# Altium schematic sheet USB.SchDoc
size A4; SheetNumber: 7; SheetTotal: 15
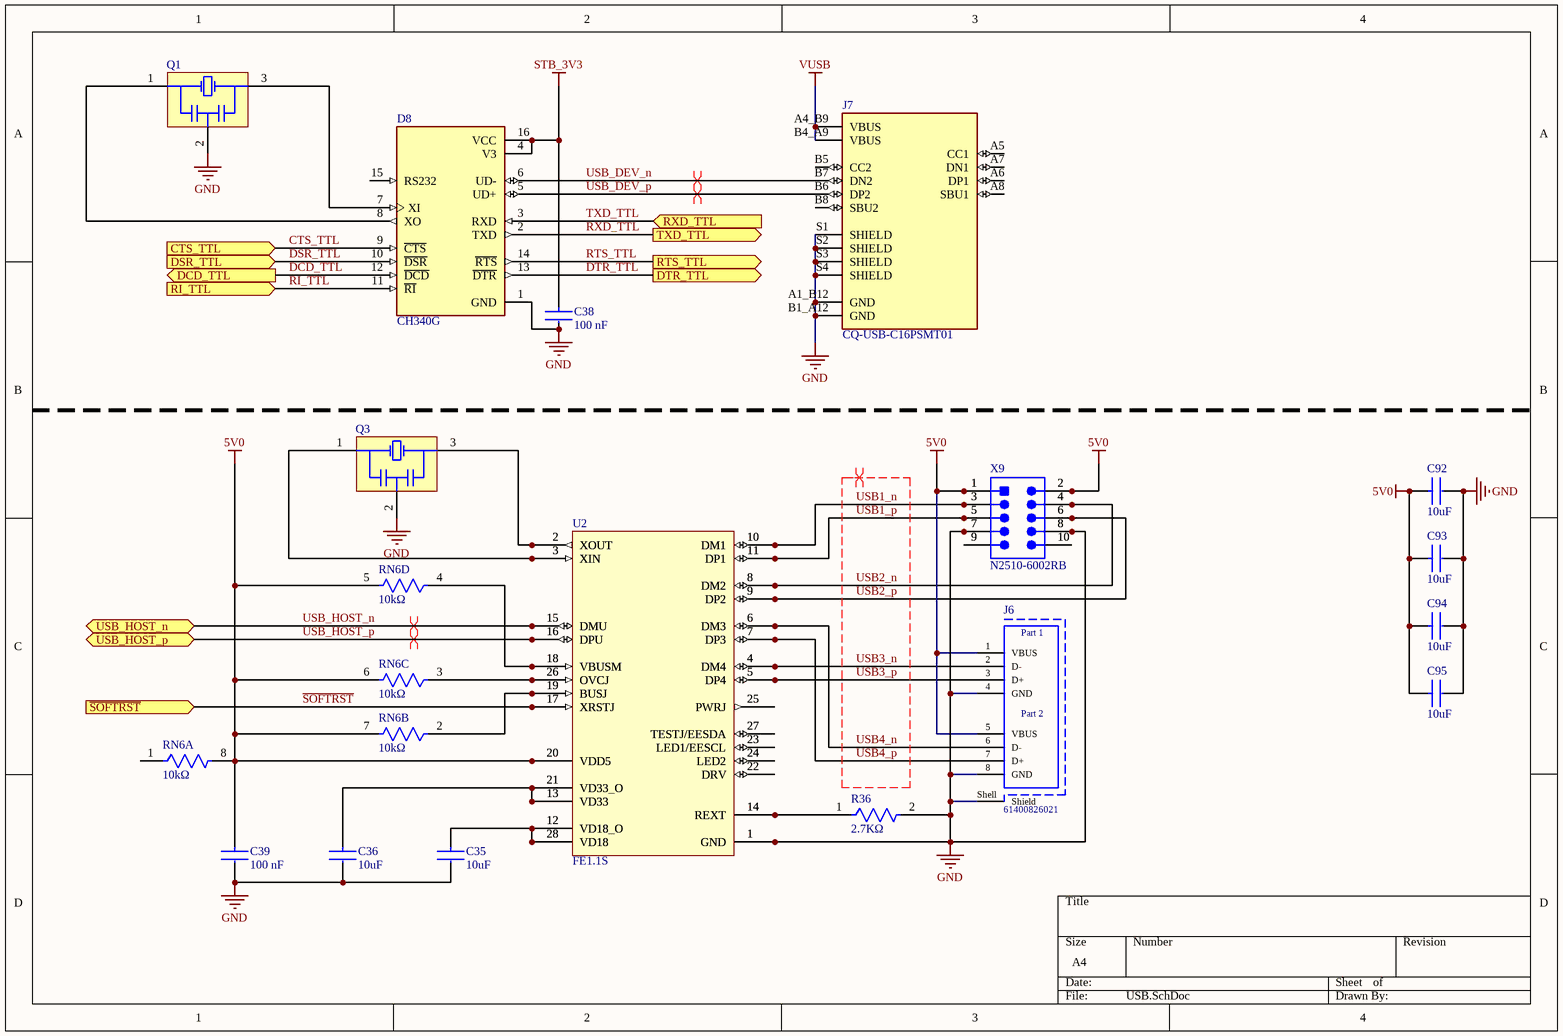
[diagram p0: USB.SchDoc]

## Parts
C35  Capacitance: 10uF  [FP-C0805C-DG-IPC_A]  (hidden comment: C0805C106K8PACTU)
C36  Capacitance: 10uF  [FP-C0805C-DG-IPC_A]  (hidden comment: C0805C106K8PACTU)
C38  Capacitance: 100 nF  [FP-CC0805-0_85-IPC_A]  (hidden comment: CC0805KRX7R9BB104)
C39  Capacitance: 100 nF  [FP-CC0805-0_85-IPC_A]  (hidden comment: CC0805KRX7R9BB104)
C92  Capacitance: 10uF  [FP-C0805C-DG-IPC_A]  (hidden comment: C0805C106K8PACTU)
C93  Capacitance: 10uF  [FP-C0805C-DG-IPC_A]  (hidden comment: C0805C106K8PACTU)
C94  Capacitance: 10uF  [FP-C0805C-DG-IPC_A]  (hidden comment: C0805C106K8PACTU)
C95  Capacitance: 10uF  [FP-C0805C-DG-IPC_A]  (hidden comment: C0805C106K8PACTU)
D8  CH340G  [SOIC127P600X180-16N]
J6  61400826021  [61400826021]
J7  CQ-USB-C16PSMT01  [SHENZHEN-CHUANGQIN-TECHNOLOGY_CQ-USB-C16PSMT01]
Q1  CSTCE12M0G55Z-R0  [MURA-CSTCE_G_V]  (value not drawn)
Q3  CSTCE12M0G55Z-R0  [MURA-CSTCE_G_V]  (value not drawn)
R36  Resistance: 2.7KΩ  [FP-AC0805-IPC_A]  (hidden comment: AC0805FR-072K7L)
RN6  Resistance: 10kΩ  [FP-CAT16-F4-MFG]  (hidden comment: CAT16-1002F4LF)  (parts A,B,C,D of 4)
U2  FE1.1S  [TSOP64P600X160-28L]
X9  N2510-6002RB  [3M-N2510-6002-10_V]

## Ports
CTS_TTL (in), DCD_TTL (out), DSR_TTL (in), DTR_TTL (out), RI_TTL (in), RTS_TTL (out), RXD_TTL (in), TXD_TTL (out), USB_HOST_n (bidir), USB_HOST_p (bidir), ~{SOFTRST} (in)

## Nets
5V0: C39.1 C92.1 C93.1 C94.1 C95.1 J6.1(VBUS) J6.5(VBUS) RN6.5 RN6.6 RN6.7 RN6.8 U2.20(VDD5) X9.1 X9.2
GND: C35.2 C36.2 C38.2 C39.2 C92.2 C93.2 C94.2 C95.2 D8.1(GND) J6.4(GND) J6.8(GND) J6.Shell(Shield) J7.A1_B12(GND) J7.B1_A12(GND) J7.S1(SHIELD) J7.S2(SHIELD) J7.S3(SHIELD) J7.S4(SHIELD) Q1.2(GND) Q3.2(GND) R36.2 U2.1(GND) X9.7 X9.8
STB_3V3: C38.1 D8.4(V3) D8.16(VCC)
VUSB: J7.A4_B9(VBUS) J7.B4_A9(VBUS)
CTS_TTL: D8.9(~{CTS}) ; port CTS_TTL
DCD_TTL: D8.12(~{DCD}) ; port DCD_TTL
DSR_TTL: D8.10(~{DSR}) ; port DSR_TTL
DTR_TTL: D8.13(~{DTR}) ; port DTR_TTL
RI_TTL: D8.11(~{RI}) ; port RI_TTL
RTS_TTL: D8.14(~{RTS}) ; port RTS_TTL
RXD_TTL: D8.2(TXD) ; port TXD_TTL
~{SOFTRST}: U2.17(XRSTJ) ; port ~{SOFTRST}
TXD_TTL: D8.3(RXD) ; port RXD_TTL
USB1_n: U2.10(DM1) X9.3
USB1_p: U2.11(DP1) X9.5
USB2_n: U2.8(DM2) X9.4
USB2_p: U2.9(DP2) X9.6
USB3_n: J6.2(D-) U2.4(DM4)
USB3_p: J6.3(D+) U2.5(DP4)
USB4_n: J6.6(D-) U2.6(DM3)
USB4_p: J6.7(D+) U2.7(DP3)
USB_DEV_n: D8.6(UD-) J7.B7(DN2)
USB_DEV_p: D8.5(UD+) J7.B6(DP2)
USB_HOST_n: U2.15(DMU) ; port USB_HOST_n
USB_HOST_p: U2.16(DPU) ; port USB_HOST_p
NetC35_1: C35.1 U2.12(VD18_O) U2.28(VD18)
NetC36_1: C36.1 U2.13(VD33) U2.21(VD33_O)
NetD8_7: D8.7(XI) Q1.3(X2)
NetD8_8: D8.8(XO) Q1.1(X1)
NetQ3_1: Q3.1(X1) U2.3(XIN)
NetQ3_3: Q3.3(X2) U2.2(XOUT)
NetR36_1: R36.1 U2.14(REXT)
NetRN6_2: RN6.2 U2.19(BUSJ)
NetRN6_3: RN6.3 U2.26(OVCJ)
NetRN6_4: RN6.4 U2.18(VBUSM)

Not connected (* = marked no-connect by the designer): D8 15(RS232); J7 A5(CC1) A6(DP1) A7(DN1) A8(SBU1) B5(CC2) B8(SBU2); RN6 1; U2 22(DRV) 23(LED1/EESCL) 24(LED2) 25(PWRJ) 27(TESTJ/EESDA); X9 9 10

## Layout directives
differential pair: USB1_n, USB1_p, USB2_n, USB2_p, USB3_n, USB3_p, USB4_n, USB4_p, USB_DEV_n, USB_DEV_p, USB_HOST_n, USB_HOST_p

## Notes on the sheet
- (in symbol 61400826021) Part 1; Part 2

## Library data of the parts
C35 C36 C92-C95 = CMP-2007-03243-2: CAP CER 10UF 10V X5R 0805; Manufacturer: KEMET; Manufacturer Part Number: C0805C106K8PACTU; Value: 10uF; Category: Cap; Case/Package: 0805
C38 C39 = CMP-2100-03606-3: CAP CER 0.1UF 50V X7R 0805; Manufacturer: Yageo; Value: 100 nF; Category: Cap; Manufacturer Part Number: CC0805KRX7R9BB104; Case/Package: 0805
D8 = CH340G: USB Interface Integrated Circuit; Value: CH340G; Case/Package: SOIC-16; Category: IC
J6 = 61400826021: USB 2.0 Type A Receptacle WR-COM, Stacked Horizontal, THT; Manufacturer: Wurth Elektronik; Contact Resistance: 20mOhm; Rated Current: 1.5A; Working Voltage: 30VAC; Connector Type: USB2.0TypeA; Packaging: Tray; Package Reference: 61400826021; Mounting Technology: THT; Datasheet URL: https://katalog.we-online.de/em/datasheet/61400826021.pdf; Operating Temperature: -40to105degC; Gender: Receptacle; Orientation: StackedHorizontal; Part Number: 61400826021; Publisher: WurthElektronik; Manufacturer URL: http://www.we-online.de
J7 = CQ-USB-C16PSMT01: C Type USB Type-C Female Plug 16 Pin Connector Power Charger Jack Port; MF: Shenzen Chuangqin Technology; MP: CQ-USB-C16PSMT01; Price: None; Package: Package; Availability: Unavailable; SnapEDA_Link: https://www.snapeda.com/parts/CQ-USB-C16PSMT01/Shenzen%20Chuangqin%20Technology/view-part/5798994/?ref=snap; Check_prices: https://www.snapeda.com/parts/CQ-USB-C16PSMT01/Shenzen%20Chuangqin%20Technology/view-part/5798994/?ref=eda; Value: *
Q1 Q3 = CMP-2000-06123-1: Ceramic Resonator, 12 MHz, +/- 0.5%, -40 to 125 degC, 3-Pin SMD, RoHS, Tape and Reel; Manufacturer: Murata; Capacitance: 33pF; Category: CrystalsandOscillators; Manufacturer Part Number: CSTCE12M0G55Z-R0; value: CSTCE12M0G55Z-R0
R36 = CMP-2001-04496-2: RES SMD 2.7K OHM 1% 1/8W 0805; Manufacturer: Yageo; Value: 2.7KΩ; Manufacturer Part Number: AC0805FR-072K7L; Category: Res; Case/Package: 0805
RN6 = CMP-07230-000003-1: RES ARRAY 4 RES 10K OHM 1206; Manufacturer: Bourns; Voltage Rating: 50V; Power Rating: 0.25W; Tolerance: 1%; Number Of Resistors: 4; Value: 10kΩ; Temperature Coefficient: 200ppm/°C; Power Per Resistor: 0.0625W; Manufacturer Part Number: CAT16-1002F4LF; Category: Res; Termination: Concave; Series: CAT16; Height: 0.6mm; Device Class L2: Resistors; Digikey Description: RES ARRAY 4 RES 10K OHM 1206; ComponentLink2Description: Datasheet; Temperature Range High: +125°C; ComponentLink2URL: https://www.bourns.com/docs/Product-Datasheets/CATCAY.pdf; Temperature: -55°C to +125°C; Temperature Range Low: -55°C; Octopart: https://octopart.com/cat16-1002f4lf-bourns-1624551; Mouser Description: Resistor Networks & Arrays 10K 1% Concave 4resistors; RoHS: TRUE; Device Class L1: Passive Components; Lead Free: Yes; Automotive: No; Package: CAT16-F4; Device Class L3: Resistor Arrays
U2 = FE1.1S: USB 2.0 HIGH SPEED 4-PORT HUB CONTROLLER; Manufacturer: Terminus Technology Inc; value: FE1.1S; Case/Package: SSOP-28; Category: IC
X9 = CMP-2000-06794-1: Male Header, Pitch 2.54 mm, 2 x 5 Postion, Height 9.91 mm, Tail Length 2.84 mm, -55 to 105 degC, RoHS, Bulk; PartNumber: N2510; Manufacturer: 3M; Pitch: 2.54mm; value: 10-Pin Shrouded Header, 2.54mm; Manufacturer Part Number: N2510-6002RB; Case/Package: IDC-10; Category: Connector